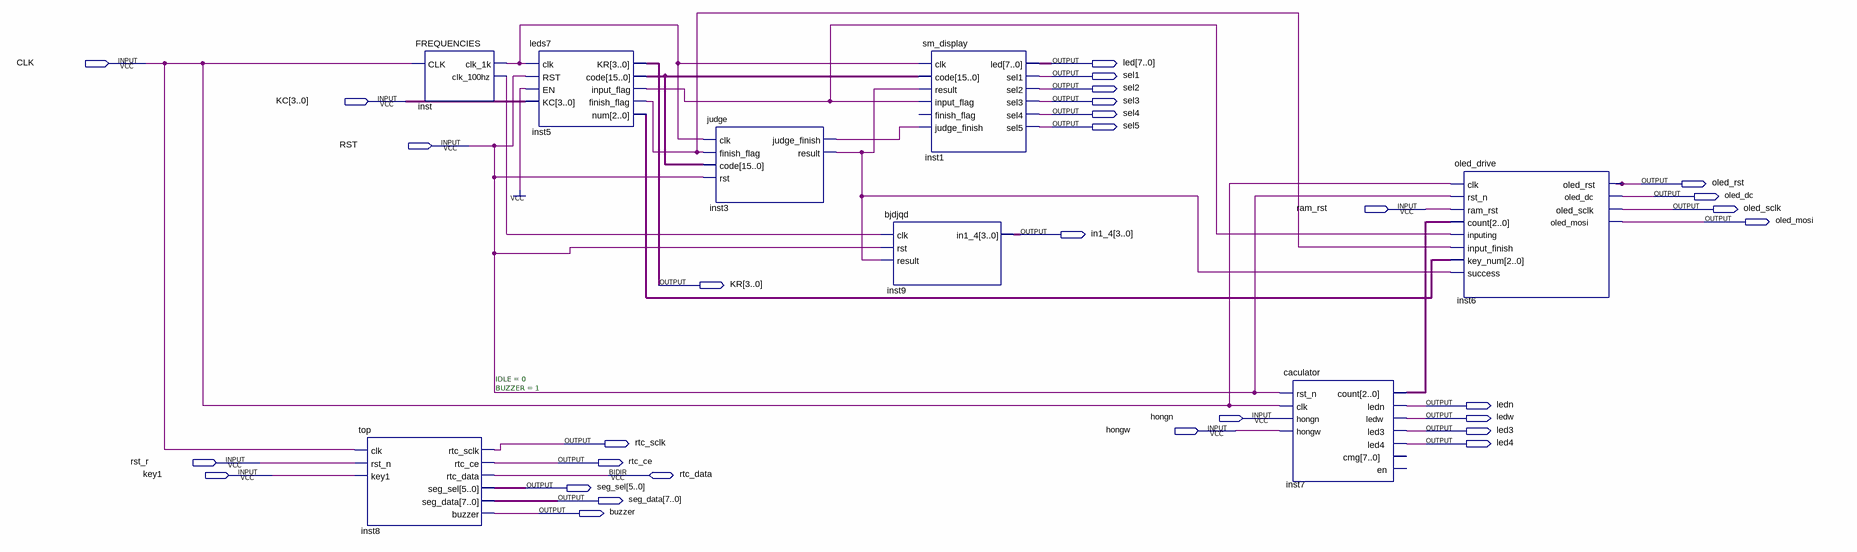
[diagram p0: schematic sheet]
// Quartus schematic block.bdf as structural Verilog: 8 symbols, 30 pins
module block (
  input  CLK,
  input  [3:0] KC,
  input  RST,
  input  ram_rst,
  input  hongn,
  input  hongw,
  input  rst_r,
  input  key1,
  inout  rtc_data,
  output [7:0] led,
  output sel1,
  output sel2,
  output sel3,
  output sel4,
  output sel5,
  output oled_rst,
  output oled_dc,
  output oled_sclk,
  output oled_mosi,
  output [3:0] in1_4,
  output [3:0] KR,
  output ledn,
  output ledw,
  output led3,
  output rtc_sclk,
  output led4,
  output rtc_ce,
  output [5:0] seg_sel,
  output [7:0] seg_data,
  output buzzer
);

  wire inst3_judge_finish, inst3_result, inst5_finish_flag, inst5_input_flag, inst_clk_1k, inst_clk_100hz;
  wire [2:0] inst5_num, inst7_count;
  wire [15:0] inst5_code;

  top #(.IDLE(0), .BUZZER(1)) inst8 (
    .clk(CLK), .rst_n(rst_r), .key1(key1), .rtc_sclk(rtc_sclk), .rtc_ce(rtc_ce), .seg_sel(seg_sel),
    .seg_data(seg_data), .buzzer(buzzer), .rtc_data(rtc_data));
  FREQUENCIES inst (.CLK(CLK), .clk_1k(inst_clk_1k), .clk_100hz(inst_clk_100hz));
  leds7 inst5 (
    .clk(inst_clk_1k), .RST(RST), .EN(1'b1), .KC(KC), .KR(KR), .code(inst5_code),
    .input_flag(inst5_input_flag), .finish_flag(inst5_finish_flag), .num(inst5_num));
  judge inst3 (
    .clk(inst_clk_1k), .finish_flag(inst5_finish_flag), .code(inst5_code), .rst(RST),
    .judge_finish(inst3_judge_finish), .result(inst3_result));
  bjdjqd inst9 (.clk(inst_clk_100hz), .rst(RST), .result(inst3_result), .in1_4(in1_4));
  sm_display inst1 (
    .clk(inst_clk_1k), .code(inst5_code), .result(inst3_result), .input_flag(inst5_input_flag),
    .judge_finish(inst3_judge_finish), .led(led), .sel1(sel1), .sel2(sel2), .sel3(sel3), .sel4(sel4),
    .sel5(sel5));  // open: finish_flag
  caculator inst7 (
    .rst_n(RST), .clk(CLK), .hongn(hongn), .hongw(hongw), .count(inst7_count), .ledn(ledn), .ledw(ledw),
    .led3(led[3]), .led4(led[4]));  // open: cmg, en
  oled_drive inst6 (
    .clk(CLK), .rst_n(RST), .ram_rst(ram_rst), .count(inst7_count), .inputing(inst5_input_flag),
    .input_finish(inst5_finish_flag), .key_num(inst5_num), .success(inst3_result), .oled_rst(oled_rst),
    .oled_dc(oled_dc), .oled_sclk(oled_sclk), .oled_mosi(oled_mosi));

  assign led3 = led[3];
  assign led4 = led[4];
endmodule
